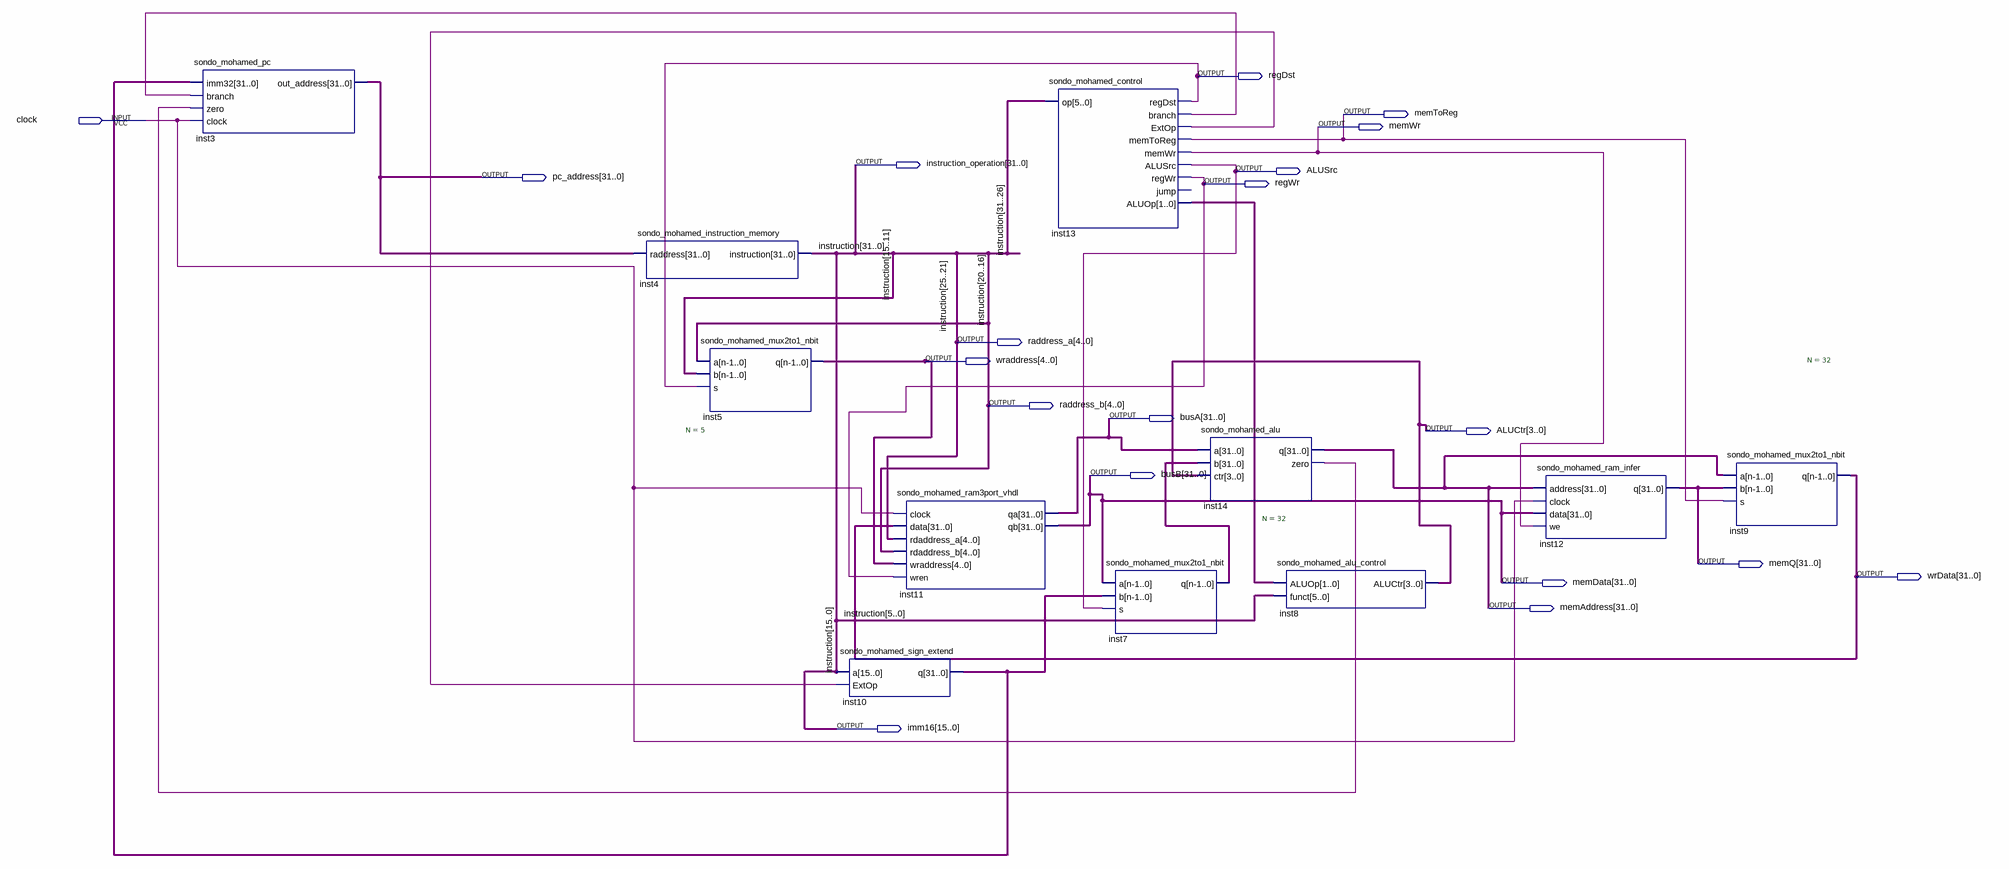
[diagram p0: schematic sheet]
// Quartus schematic Mohamed_sondo_single_cycle_cpu.bdf as structural Verilog: 11 symbols, 19 pins
module Mohamed_sondo_single_cycle_cpu (
  input  clock,
  output regDst,
  output memToReg,
  output memWr,
  output [31:0] instruction_operation,
  output ALUSrc,
  output [31:0] pc_address,
  output regWr,
  output [4:0] raddress_a,
  output [4:0] wraddress,
  output [4:0] raddress_b,
  output [31:0] busA,
  output [3:0] ALUCtr,
  output [31:0] busB,
  output [31:0] memQ,
  output [31:0] wrData,
  output [31:0] memData,
  output [31:0] memAddress,
  output [15:0] imm16
);

  wire inst13_branch, inst13_extop, inst14_zero;
  wire [1:0] inst13_aluop;
  wire [31:0] inst7_q, inst10_q;

  sondo_mohamed_pc inst3 (
    .imm32(inst10_q), .branch(inst13_branch), .zero(inst14_zero), .clock(clock), .out_address(pc_address));
  sondo_mohamed_instruction_memory inst4 (.raddress(pc_address), .instruction({instruction_operation[31:16], imm16}));
  sondo_mohamed_mux2to1_nbit #(.N(5)) inst5 (
    .a(instruction_operation[20:16]), .b(imm16[15:11]), .s(regDst), .q(wraddress));
  sondo_mohamed_sign_extend inst10 (.a(imm16), .ExtOp(inst13_extop), .q(inst10_q));
  sondo_mohamed_ram3port_vhdl inst11 (
    .clock(clock), .data(wrData), .rdaddress_a(instruction_operation[25:21]),
    .rdaddress_b(instruction_operation[20:16]), .wraddress(wraddress), .wren(regWr), .qa(busA), .qb(busB));
  sondo_mohamed_control inst13 (
    .op(instruction_operation[31:26]), .regDst(regDst), .branch(inst13_branch), .ExtOp(inst13_extop),
    .memToReg(memToReg), .memWr(memWr), .ALUSrc(ALUSrc), .regWr(regWr), .ALUOp(inst13_aluop));  // open: jump
  sondo_mohamed_mux2to1_nbit #(.N(32)) inst7 (.a(busB), .b(inst10_q), .s(ALUSrc), .q(inst7_q));
  sondo_mohamed_alu inst14 (.a(busA), .b(inst7_q), .ctr(ALUCtr), .q(memAddress), .zero(inst14_zero));
  sondo_mohamed_alu_control inst8 (.ALUOp(inst13_aluop), .funct(imm16[5:0]), .ALUCtr(ALUCtr));
  sondo_mohamed_ram_infer inst12 (.address(memAddress), .clock(clock), .data(busB), .we(memWr), .q(memQ));
  sondo_mohamed_mux2to1_nbit #(.N(32)) inst9 (.a(memAddress), .b(memQ), .s(memToReg), .q(wrData));

  assign instruction_operation[15:0] = imm16;
  assign memData = busB;
  assign raddress_a = instruction_operation[25:21];
  assign raddress_b = instruction_operation[20:16];

  // Other names for the same wires on the sheet: instruction[31:0] = {instruction_operation[31:16], imm16}
endmodule
